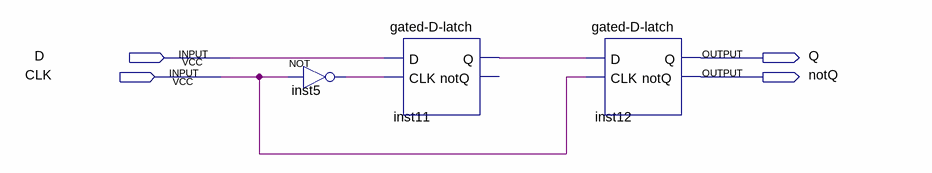
[diagram p0: schematic sheet]
// Quartus schematic aula2.bdf as structural Verilog: 3 symbols, 4 pins
module aula2 (
  input  D,
  input  CLK,
  output Q,
  output notQ
);

  wire inst5_out, inst11_q;

  not inst5 (inst5_out, CLK);
  \gated-D-latch  inst11 (.D(D), .CLK(inst5_out), .Q(inst11_q));  // open: notQ
  \gated-D-latch  inst12 (.D(inst11_q), .CLK(CLK), .Q(Q), .notQ(notQ));
endmodule
